# Altium schematic sheet mcu_stm32h5.SchDoc
size D; SheetNumber: 2
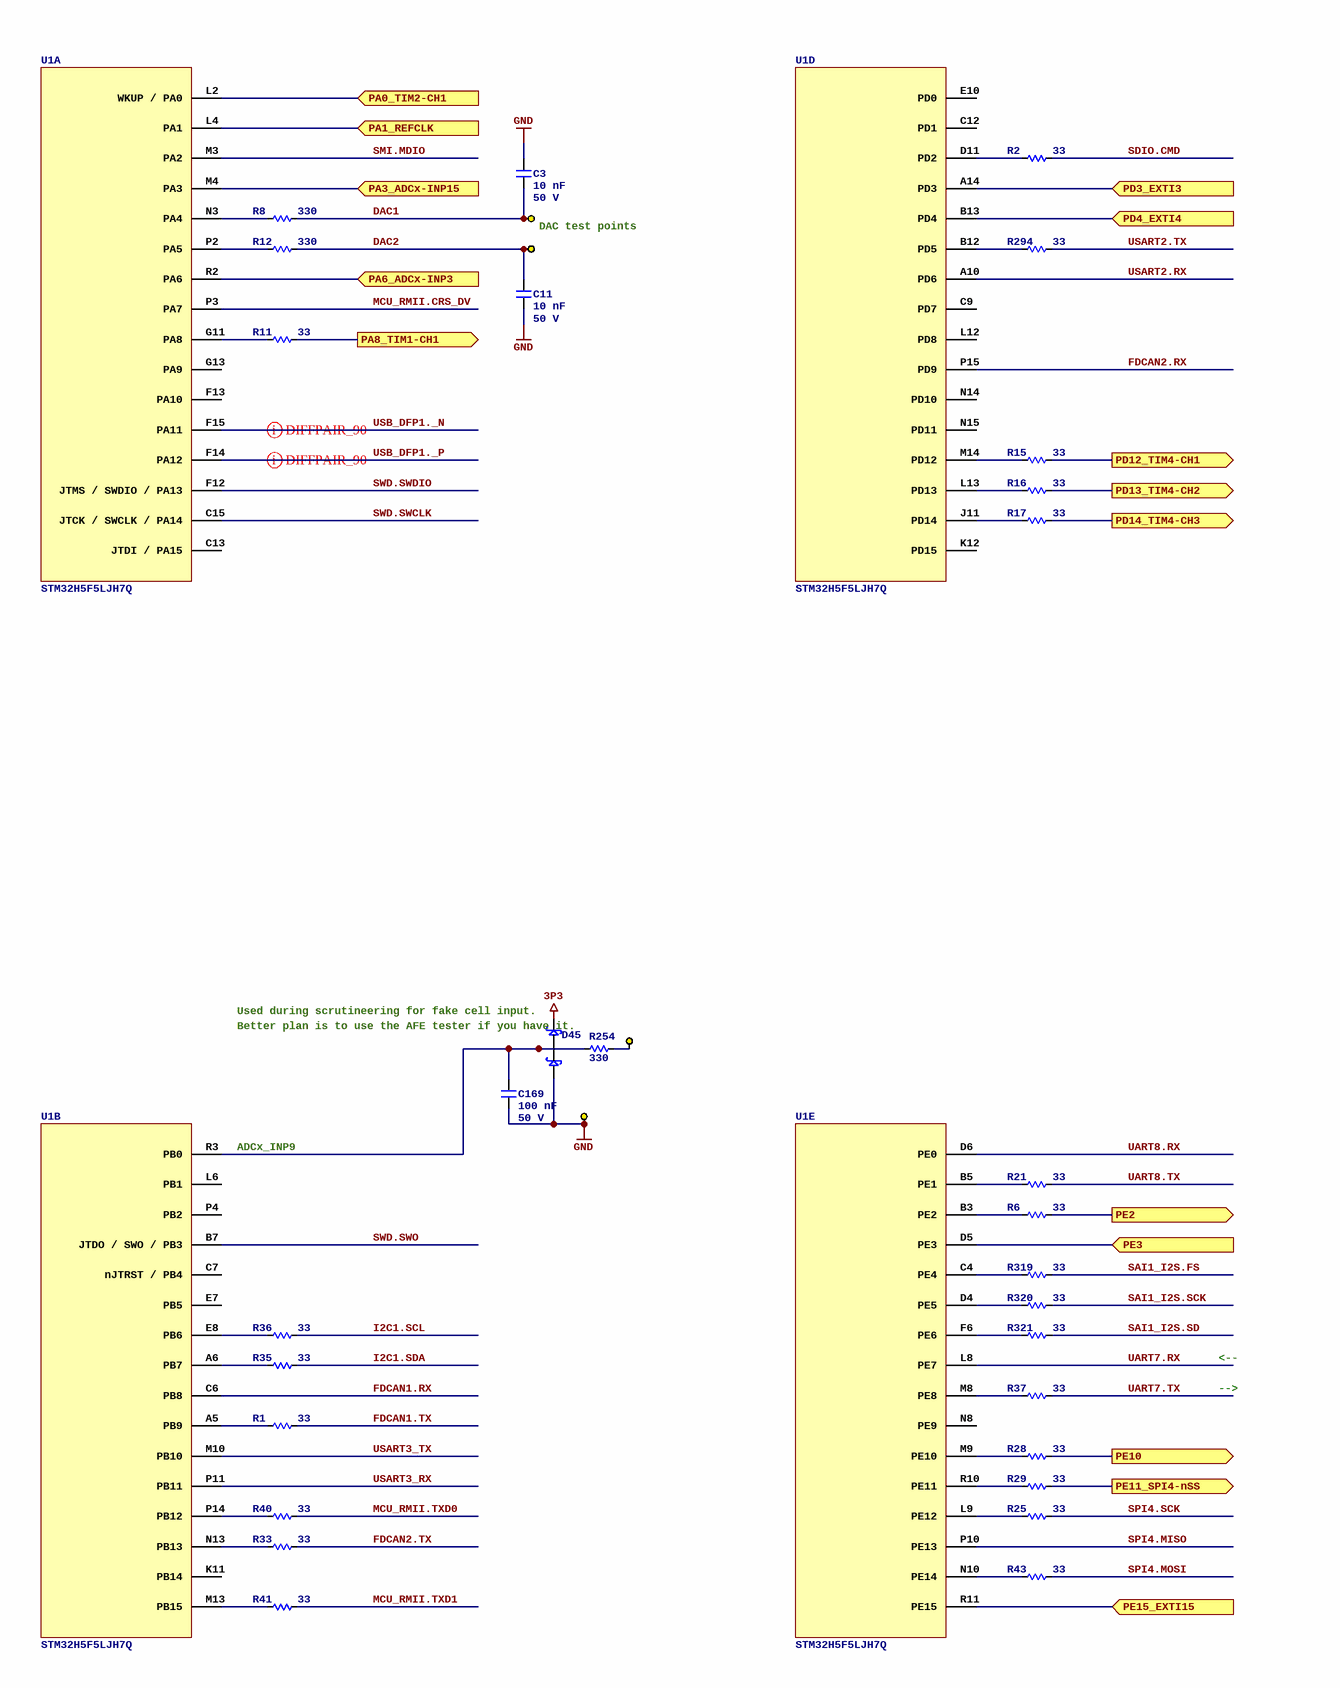
[diagram p0: mcu_stm32h5.SchDoc, top left]
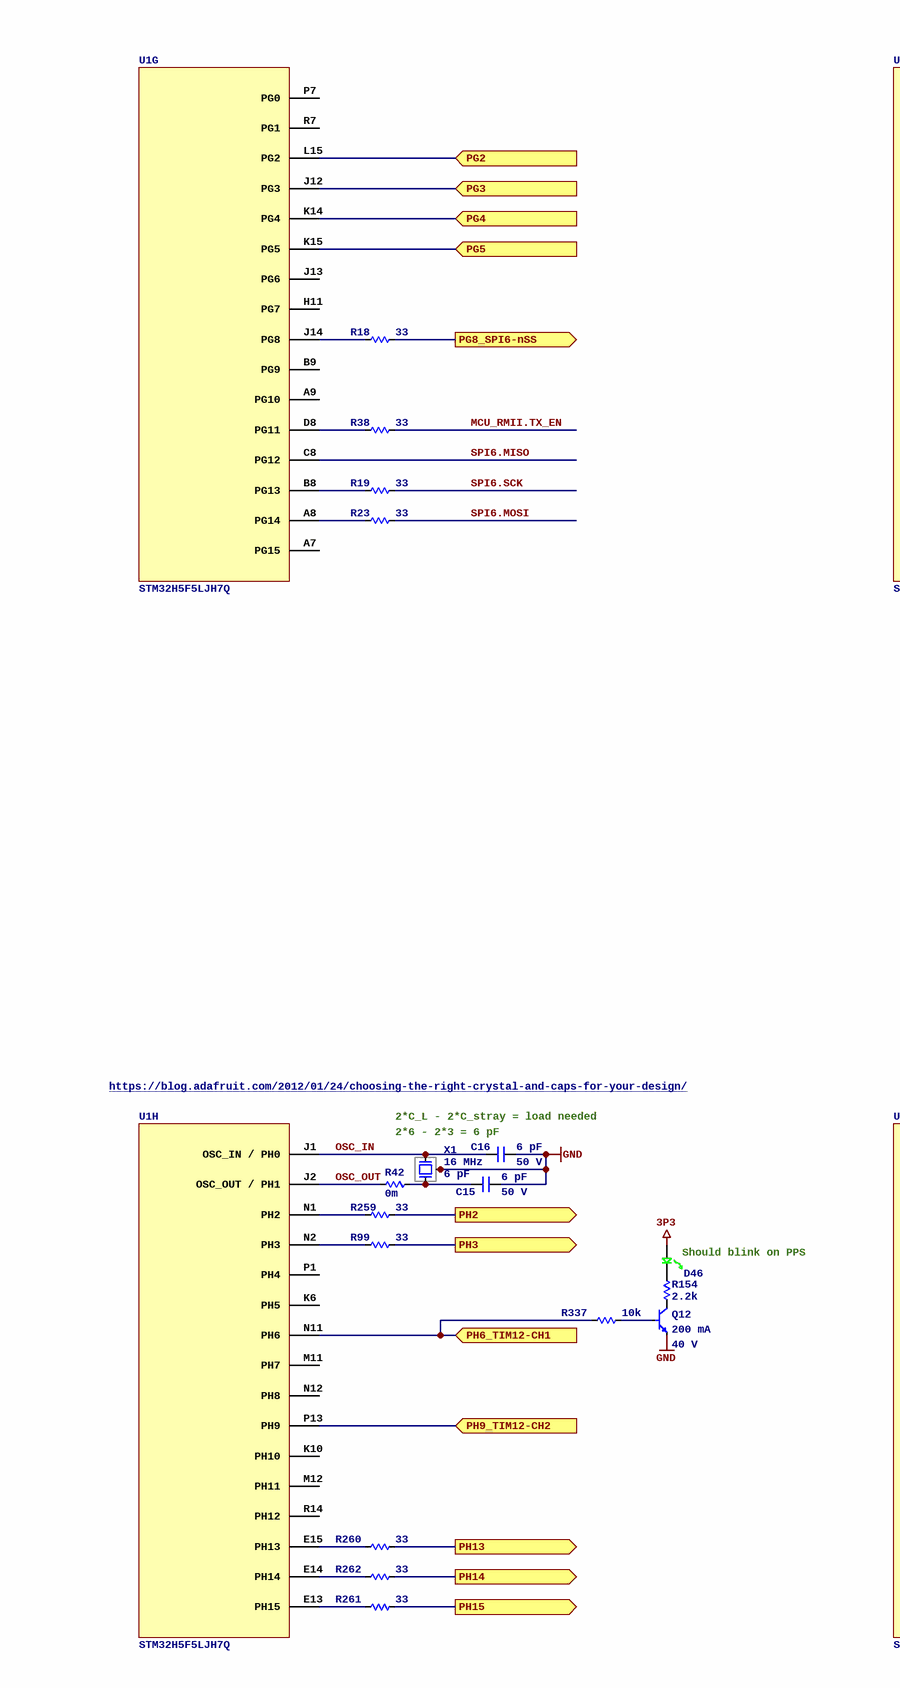
[diagram p1: mcu_stm32h5.SchDoc, top middle]
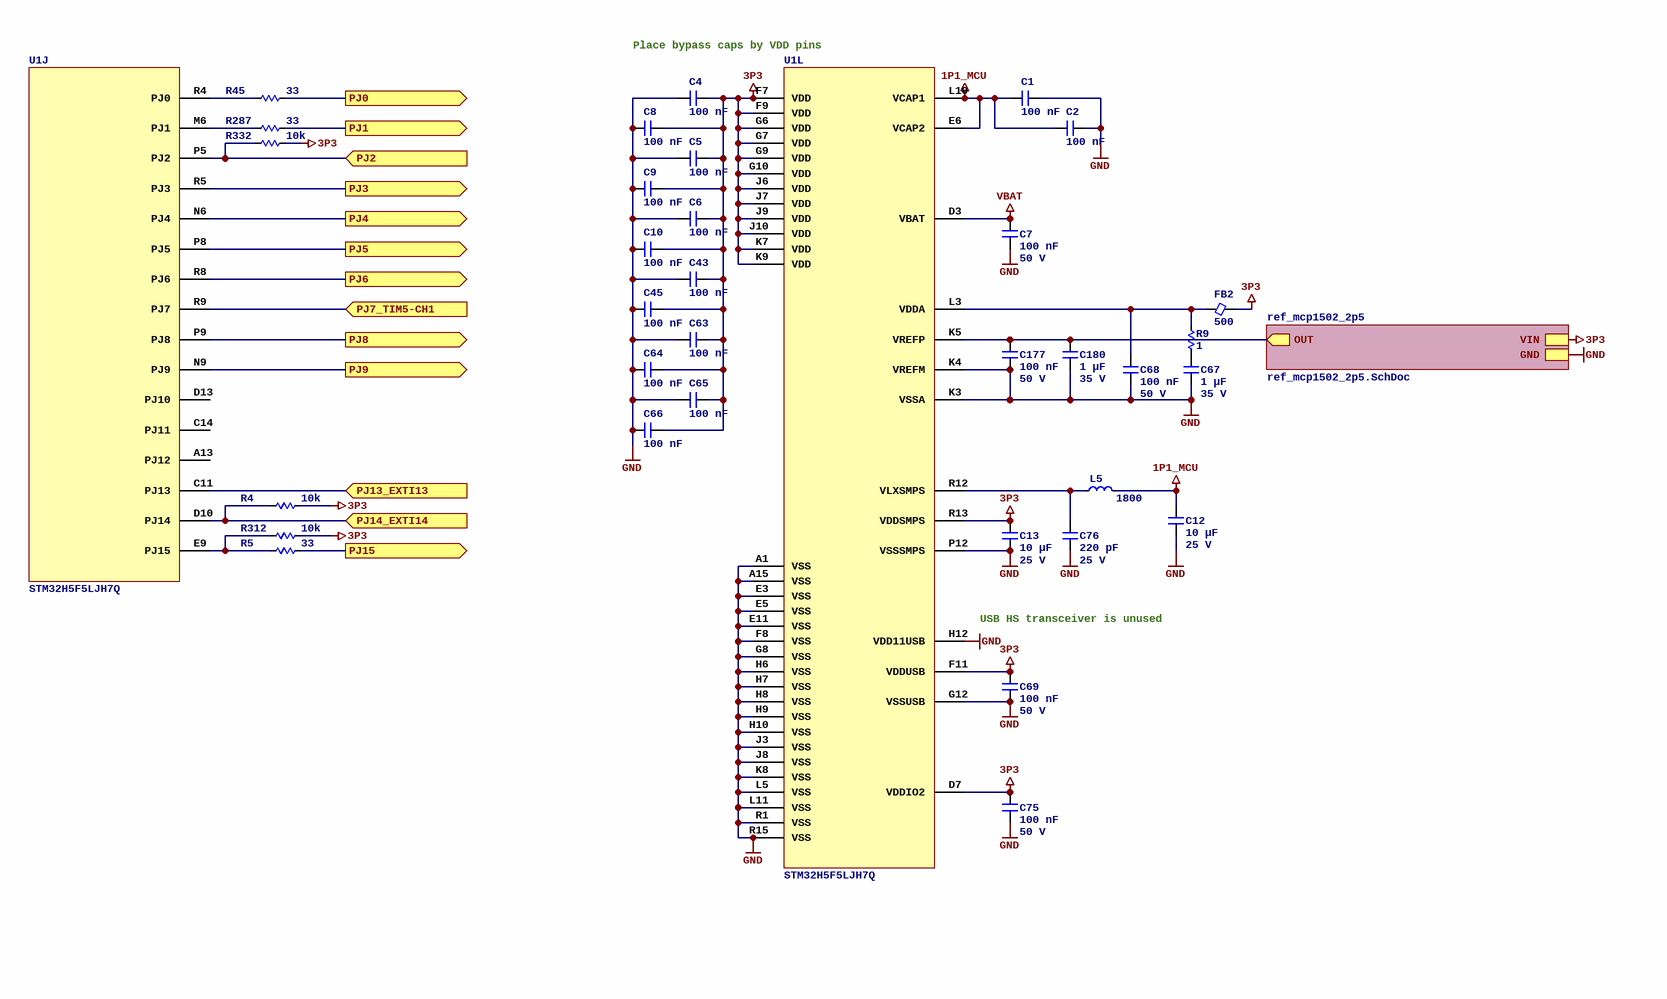
[diagram p2: mcu_stm32h5.SchDoc, top right]
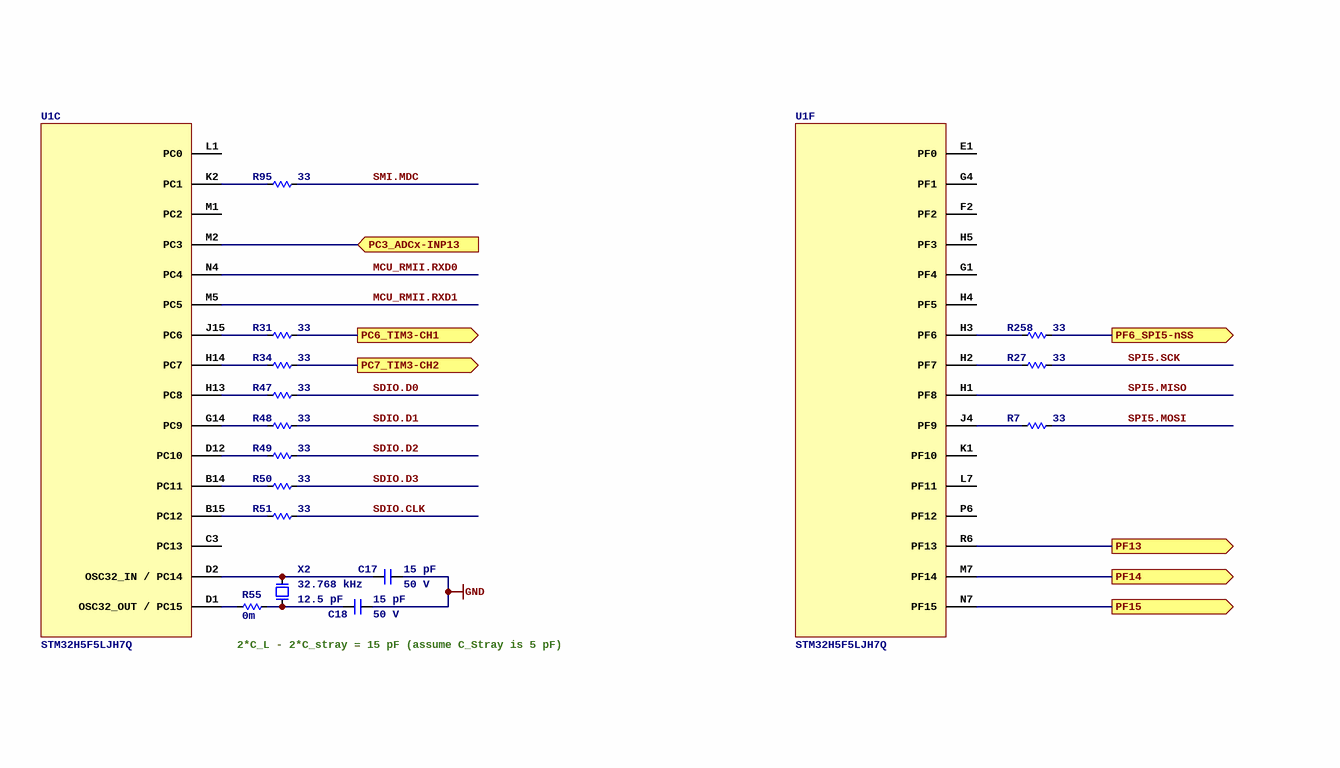
[diagram p3: mcu_stm32h5.SchDoc, bottom left]
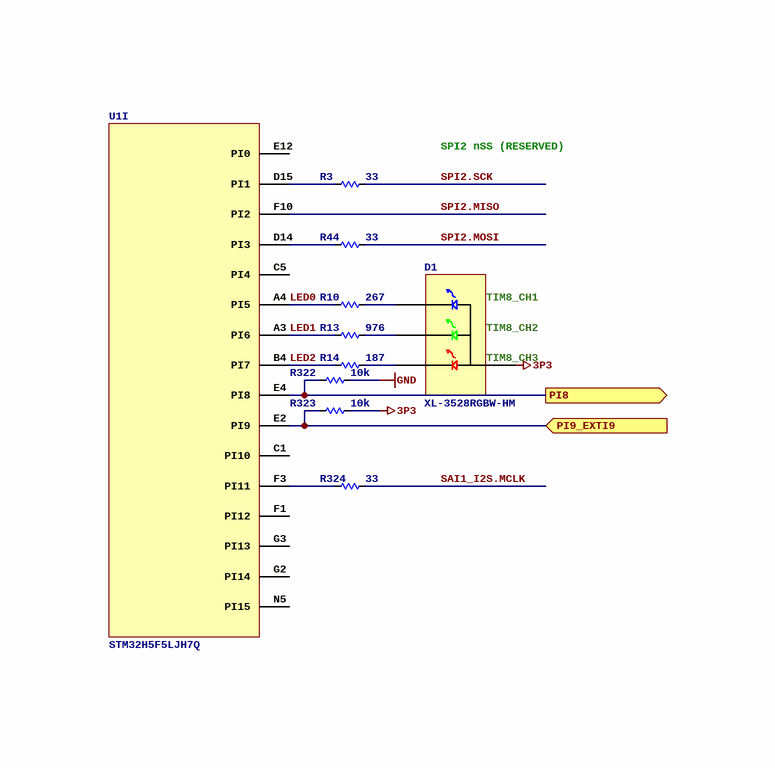
[diagram p4: mcu_stm32h5.SchDoc, bottom middle]
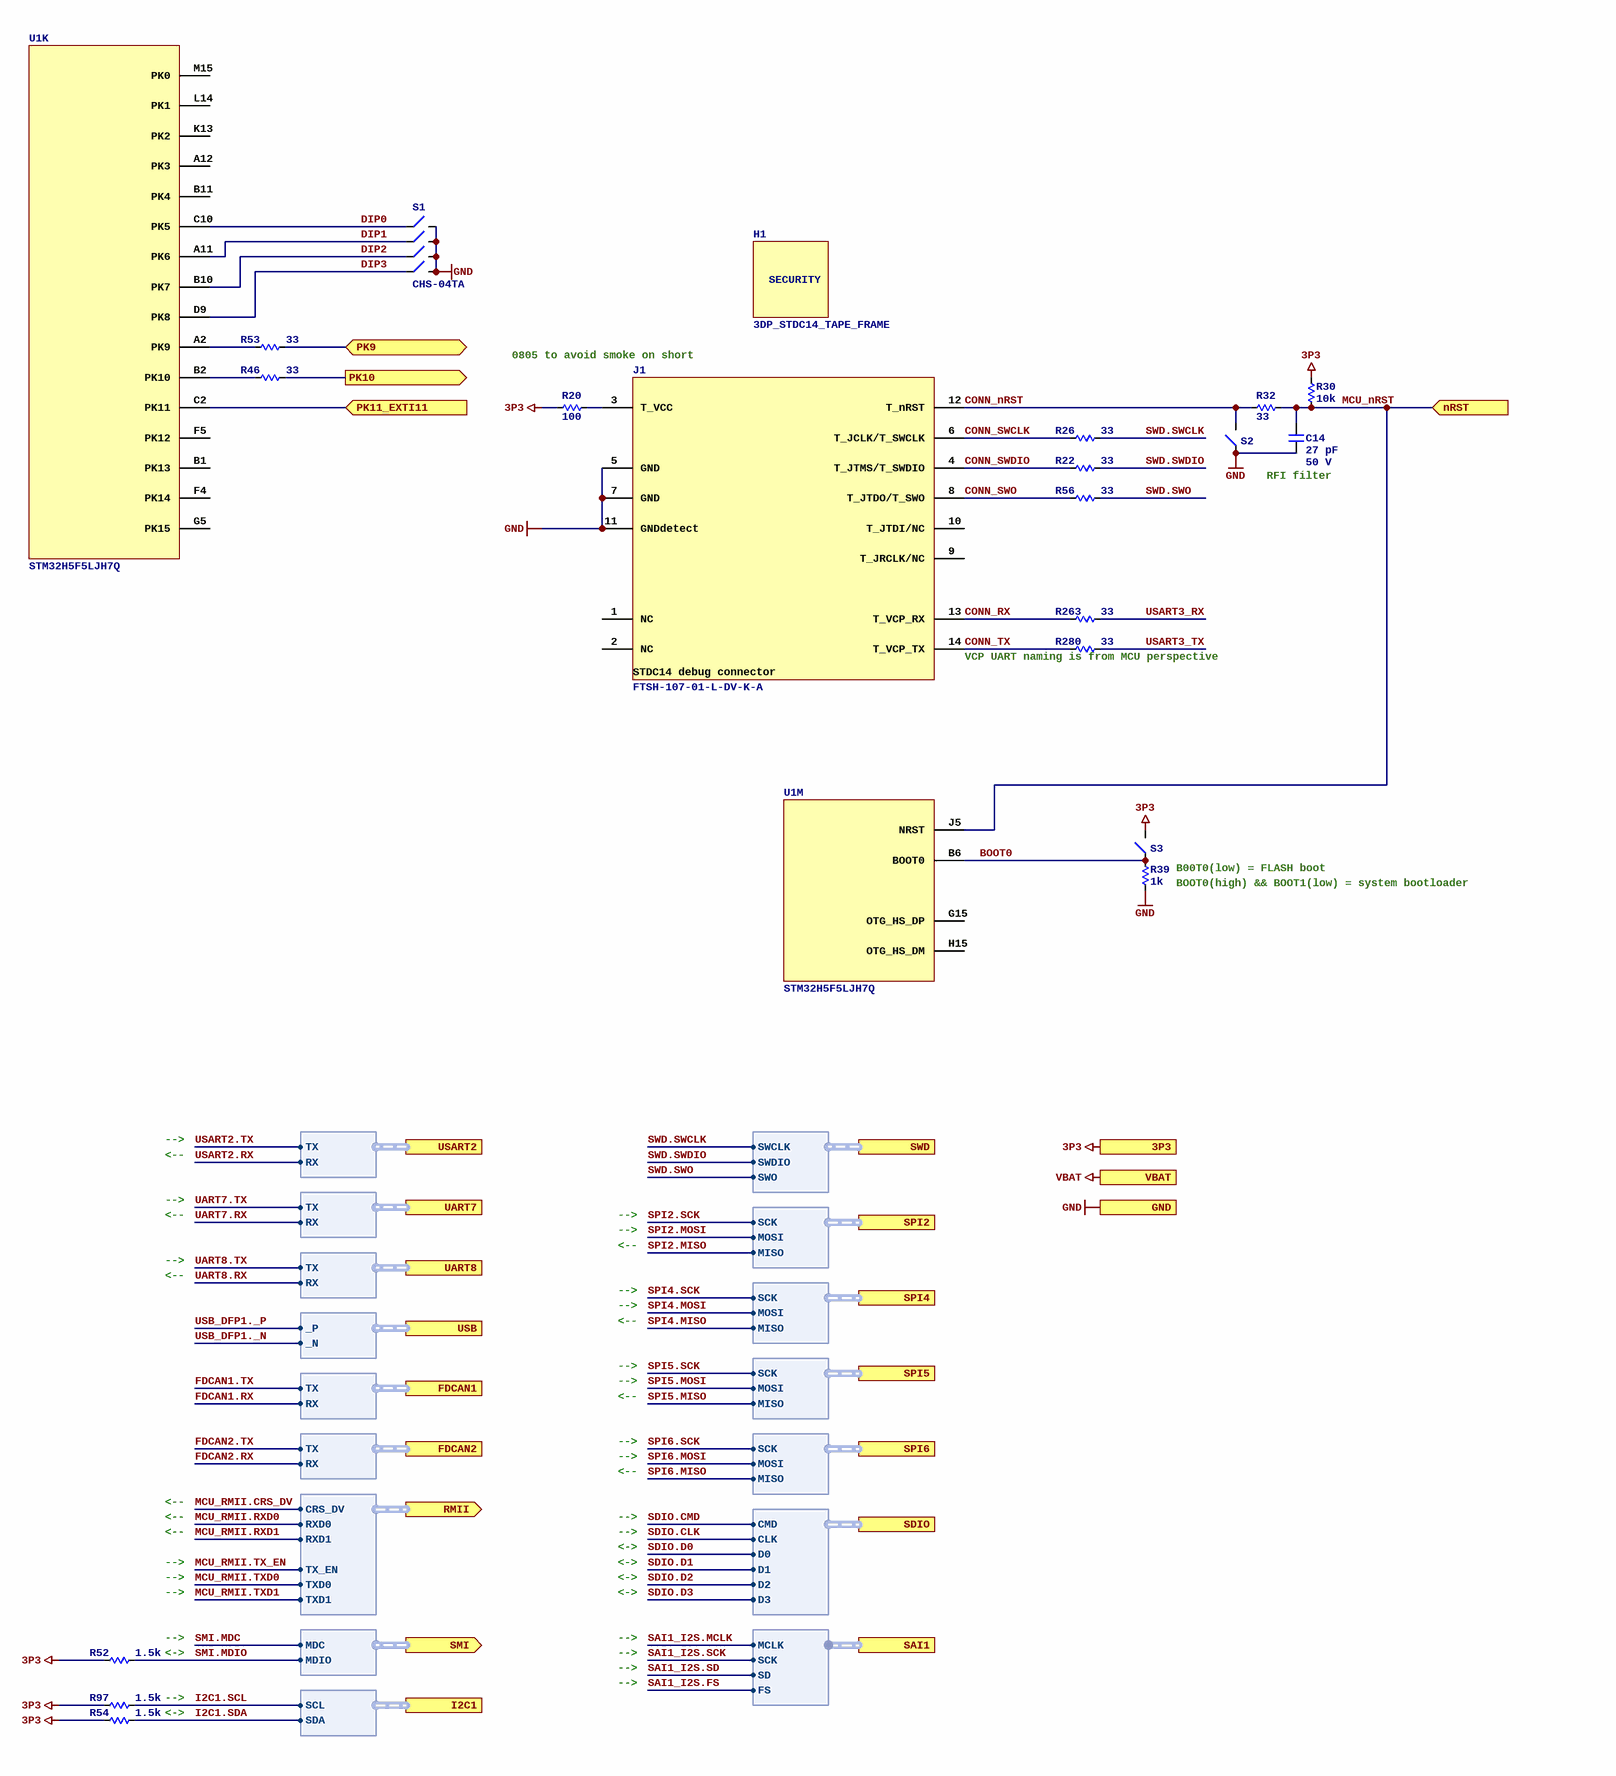
[diagram p5: mcu_stm32h5.SchDoc, bottom right]

## Parts
C1  Capacitance: 100 nF  [C0402]  (hidden comment: CL05B104KB54PNC)
C2  Capacitance: 100 nF  [C0402]  (hidden comment: CL05B104KB54PNC)
C3  Capacitance: 10 nF  Voltage Rating: 50 V  [C0402]  (hidden comment: CL05B103KB5NNNC)
C4  Capacitance: 100 nF  [C0402]  (hidden comment: CL05B104KB54PNC)
C5  Capacitance: 100 nF  [C0402]  (hidden comment: CL05B104KB54PNC)
C6  Capacitance: 100 nF  [C0402]  (hidden comment: CL05B104KB54PNC)
C7  Capacitance: 100 nF  Voltage Rating: 50 V  [C0402]  (hidden comment: CL05B104KB54PNC)
C8  Capacitance: 100 nF  [C0402]  (hidden comment: CL05B104KB54PNC)
C9  Capacitance: 100 nF  [C0402]  (hidden comment: CL05B104KB54PNC)
C10  Capacitance: 100 nF  [C0402]  (hidden comment: CL05B104KB54PNC)
C11  Capacitance: 10 nF  Voltage Rating: 50 V  [C0402]  (hidden comment: CL05B103KB5NNNC)
C12  Capacitance: 10 µF  Voltage Rating: 25 V  [C0603]  (hidden comment: CL10A106MA8NRNC)
C13  Capacitance: 10 µF  Voltage Rating: 25 V  [C0603]  (hidden comment: CL10A106MA8NRNC)
C14  Capacitance: 27 pF  Voltage Rating: 50 V  [C0402]  (hidden comment: 0402CG270J500NT)
C15  Capacitance: 6 pF  Voltage Rating: 50 V  [C0402]  (hidden comment: 0402CG6R0C500NT)
C16  Capacitance: 6 pF  Voltage Rating: 50 V  [C0402]  (hidden comment: 0402CG6R0C500NT)
C17  Capacitance: 15 pF  Voltage Rating: 50 V  [C0402]  (hidden comment: 0402CG150J500NT)
C18  Capacitance: 15 pF  Voltage Rating: 50 V  [C0402]  (hidden comment: 0402CG150J500NT)
C43  Capacitance: 100 nF  [C0402]  (hidden comment: CL05B104KB54PNC)
C45  Capacitance: 100 nF  [C0402]  (hidden comment: CL05B104KB54PNC)
C63  Capacitance: 100 nF  [C0402]  (hidden comment: CL05B104KB54PNC)
C64  Capacitance: 100 nF  [C0402]  (hidden comment: CL05B104KB54PNC)
C65  Capacitance: 100 nF  [C0402]  (hidden comment: CL05B104KB54PNC)
C66  Capacitance: 100 nF  [C0402]  (hidden comment: CL05B104KB54PNC)
C67  Capacitance: 1 µF  Voltage Rating: 35 V  [C0603]  (hidden comment: GMK107AB7105KAHT)
C68  Capacitance: 100 nF  Voltage Rating: 50 V  [C0402]  (hidden comment: CL05B104KB54PNC)
C69  Capacitance: 100 nF  Voltage Rating: 50 V  [C0402]  (hidden comment: CL05B104KB54PNC)
C75  Capacitance: 100 nF  Voltage Rating: 50 V  [C0402]  (hidden comment: CL05B104KB54PNC)
C76  Capacitance: 220 pF  Voltage Rating: 25 V  [C0402]  (hidden comment: 04023A221JAT2A)
C169  Capacitance: 100 nF  Voltage Rating: 50 V  [C0402]  (hidden comment: CL05B104KB54PNC)
C177  Capacitance: 100 nF  Voltage Rating: 50 V  [C0402]  (hidden comment: CL05B104KB54PNC)
C180  Capacitance: 1 µF  Voltage Rating: 35 V  [C0603]  (hidden comment: GMK107AB7105KAHT)
D1  XL-3528RGBW-HM  [LED_RGB_SMD3528-4P]
D45  BAT54SLT1G  [3SOT23]  (value not drawn)
D46  LTST-C190GKT  [LED_0603P_GREEN]  (value not drawn)
FB2  Current Rating (mA): 500  [FB0402]  (hidden comment: BLM15AX601SN1D)
H1  3DP_STDC14_TAPE_FRAME  [3DP_STDC14_TAPE_FRAME]
J1  FTSH-107-01-L-DV-K-A  [SAMTEC_FTSH-107-01-L-DV-K-A]
L5  Current Rating (mA): 1800  [MURATA_DFE201612E]  (hidden comment: DFE201612E-2R2M=P2)
Q12  Current: 200 mA  Voltage: 40 V  [3SOT523]  (hidden comment: MMBT3904T)
R1  value 33  [R0402]  (hidden comment: 0402WGF330JTCE)
R2  value 33  [R0402]  (hidden comment: 0402WGF330JTCE)
R3  value 33  [R0402]  (hidden comment: 0402WGF330JTCE)
R4  value 10k  [R0402]  (hidden comment: 0402WGF1002TCE)
R5  value 33  [R0402]  (hidden comment: 0402WGF330JTCE)
R6  value 33  [R0402]  (hidden comment: 0402WGF330JTCE)
R7  value 33  [R0402]  (hidden comment: 0402WGF330JTCE)
R8  value 330  [R0402]  (hidden comment: 0402WGF3300TCE)
R9  value 1  [R0402]  (hidden comment: CRCW04021R00FKEDC)
R10  value 267  [R0402]  (hidden comment: FRC0402F2670TS)
R11  value 33  [R0402]  (hidden comment: 0402WGF330JTCE)
R12  value 330  [R0402]  (hidden comment: 0402WGF3300TCE)
R13  value 976  [R0402]  (hidden comment: RTT029760FTH)
R14  value 187  [R0402]  (hidden comment: ERJ2RKF1870X)
R15  value 33  [R0402]  (hidden comment: 0402WGF330JTCE)
R16  value 33  [R0402]  (hidden comment: 0402WGF330JTCE)
R17  value 33  [R0402]  (hidden comment: 0402WGF330JTCE)
R18  value 33  [R0402]  (hidden comment: 0402WGF330JTCE)
R19  value 33  [R0402]  (hidden comment: 0402WGF330JTCE)
R20  value 100  [R0805]  (hidden comment: ERJP06F1000V)
R21  value 33  [R0402]  (hidden comment: 0402WGF330JTCE)
R22  value 33  [R0402]  (hidden comment: 0402WGF330JTCE)
R23  value 33  [R0402]  (hidden comment: 0402WGF330JTCE)
R25  value 33  [R0402]  (hidden comment: 0402WGF330JTCE)
R26  value 33  [R0402]  (hidden comment: 0402WGF330JTCE)
R27  value 33  [R0402]  (hidden comment: 0402WGF330JTCE)
R28  value 33  [R0402]  (hidden comment: 0402WGF330JTCE)
R29  value 33  [R0402]  (hidden comment: 0402WGF330JTCE)
R30  value 10k  [R0402]  (hidden comment: 0402WGF1002TCE)
R31  value 33  [R0402]  (hidden comment: 0402WGF330JTCE)
R32  value 33  [R0402]  (hidden comment: 0402WGF330JTCE)
R33  value 33  [R0402]  (hidden comment: 0402WGF330JTCE)
R34  value 33  [R0402]  (hidden comment: 0402WGF330JTCE)
R35  value 33  [R0402]  (hidden comment: 0402WGF330JTCE)
R36  value 33  [R0402]  (hidden comment: 0402WGF330JTCE)
R37  value 33  [R0402]  (hidden comment: 0402WGF330JTCE)
R38  value 33  [R0402]  (hidden comment: 0402WGF330JTCE)
R39  value 1k  [R0402]  (hidden comment: 0402WGF1001TCE)
R40  value 33  [R0402]  (hidden comment: 0402WGF330JTCE)
R41  value 33  [R0402]  (hidden comment: 0402WGF330JTCE)
R42  value 0m  [R0402]  (hidden comment: 0402WGF0000TCE)
R43  value 33  [R0402]  (hidden comment: 0402WGF330JTCE)
R44  value 33  [R0402]  (hidden comment: 0402WGF330JTCE)
R45  value 33  [R0402]  (hidden comment: 0402WGF330JTCE)
R46  value 33  [R0402]  (hidden comment: 0402WGF330JTCE)
R47  value 33  [R0402]  (hidden comment: 0402WGF330JTCE)
R48  value 33  [R0402]  (hidden comment: 0402WGF330JTCE)
R49  value 33  [R0402]  (hidden comment: 0402WGF330JTCE)
R50  value 33  [R0402]  (hidden comment: 0402WGF330JTCE)
R51  value 33  [R0402]  (hidden comment: 0402WGF330JTCE)
R52  value 1.5k  [R0402]  (hidden comment: 0402WGF1501TCE)
R53  value 33  [R0402]  (hidden comment: 0402WGF330JTCE)
R54  value 1.5k  [R0402]  (hidden comment: 0402WGF1501TCE)
R55  value 0m  [R0402]  (hidden comment: 0402WGF0000TCE)
R56  value 33  [R0402]  (hidden comment: 0402WGF330JTCE)
R95  value 33  [R0402]  (hidden comment: 0402WGF330JTCE)
R97  value 1.5k  [R0402]  (hidden comment: 0402WGF1501TCE)
R99  value 33  [R0402]  (hidden comment: 0402WGF330JTCE)
R154  value 2.2k  [R0402]  (hidden comment: 0402WGF2201TCE)
R254  value 330  [R0402]  (hidden comment: 0402WGF3300TCE)
R258  value 33  [R0402]  (hidden comment: 0402WGF330JTCE)
R259  value 33  [R0402]  (hidden comment: 0402WGF330JTCE)
R260  value 33  [R0402]  (hidden comment: 0402WGF330JTCE)
R261  value 33  [R0402]  (hidden comment: 0402WGF330JTCE)
R262  value 33  [R0402]  (hidden comment: 0402WGF330JTCE)
R263  value 33  [R0402]  (hidden comment: 0402WGF330JTCE)
R280  value 33  [R0402]  (hidden comment: 0402WGF330JTCE)
R287  value 33  [R0402]  (hidden comment: 0402WGF330JTCE)
R294  value 33  [R0402]  (hidden comment: 0402WGF330JTCE)
R312  value 10k  [R0402]  (hidden comment: 0402WGF1002TCE)
R319  value 33  [R0402]  (hidden comment: 0402WGF330JTCE)
R320  value 33  [R0402]  (hidden comment: 0402WGF330JTCE)
R321  value 33  [R0402]  (hidden comment: 0402WGF330JTCE)
R322  value 10k  [R0402]  (hidden comment: 0402WGF1002TCE)
R323  value 10k  [R0402]  (hidden comment: 0402WGF1002TCE)
R324  value 33  [R0402]  (hidden comment: 0402WGF330JTCE)
R332  value 10k  [R0402]  (hidden comment: 0402WGF1002TCE)
R337  value 10k  [R0402]  (hidden comment: 0402WGF1002TCE)
S1  CHS-04TA  [SWITCH_NIDEC_CHS-04TA]
S2  TS-1092S-B3D2-G  [SWITCH_TS-1092S-B3D2-G]  (value not drawn)
S3  TS-1092S-B3D2-G  [SWITCH_TS-1092S-B3D2-G]  (value not drawn)
TP1  RH-5002  [TP_RH-5002]  (value not drawn)
TP2  RH-5002  [TP_RH-5002]  (value not drawn)
TP51  RH-5000  [TP_RH-5000]  (value not drawn)
TP52  RH-5001  [TP_RH-5001]  (value not drawn)
U1  STM32H5F5LJH7Q  [ST_TFBGA225]  (parts A,B,C,D,E,F,G,H,I,J,K,L,M of 13)
X1  Frequency: 16 MHz  Capacitance: 6 pF  [4_SMD_2.0X1.6MM]  (hidden comment: XRCGB16M000FXN00R0)
X2  Frequency: 32.768 kHz  Capacitance: 12.5 pF  [XTAL_TXC_9HT10]  (hidden comment: 9HT10-32.768KEZF-T)

## Sub-sheets
ref_mcp1502_2p5 = ref_mcp1502_2p5.SchDoc: VIN, GND, OUT (out)

## Ports
3P3, FDCAN1 (harness CAN), FDCAN2 (harness CAN), GND, I2C1 (harness I2C), nRST (in), PA0_TIM2-CH1 (in), PA1_REFCLK (in), PA3_ADCx-INP15 (in), PA6_ADCx-INP3 (in), PA8_TIM1-CH1 (out), PC3_ADCx-INP13 (in), PC6_TIM3-CH1 (out), PC7_TIM3-CH2 (out), PD3_EXTI3 (in), PD4_EXTI4 (in), PD12_TIM4-CH1 (out), PD13_TIM4-CH2 (out), PD14_TIM4-CH3 (out), PE2 (out), PE3 (in), PE10 (out), PE11_SPI4-nSS (out), PE15_EXTI15 (in), PF6_SPI5-nSS (out), PF13 (out), PF14 (out), PF15 (out), PG2 (in), PG3 (in), PG4 (in), PG5 (in), PG8_SPI6-nSS (out), PH2 (out), PH3 (out), PH6_TIM12-CH1 (in), PH9_TIM12-CH2 (in), PH13 (out), PH14 (out), PH15 (out), PI8 (out), PI9_EXTI9 (in), PJ0 (out), PJ1 (out), PJ2 (in), PJ3 (out), PJ4 (out), PJ5 (out), PJ6 (out), PJ7_TIM5-CH1 (in), PJ8 (out), PJ9 (out), PJ13_EXTI13 (in), PJ14_EXTI14 (in), PJ15 (out), PK9 (bidir), PK10 (out), PK11_EXTI11 (in), RMII (out, harness RMII), SAI1 (harness I2S), SDIO (harness SDIO), SMI (out, harness SMI), SPI2 (harness SPI), SPI4 (harness SPI), SPI5 (harness SPI), SPI6 (harness SPI), SWD (harness SWD), UART7 (harness UART), UART8 (harness UART), USART2 (harness UART), USB (harness DIFF), VBAT

## Harnesses
CAN: TX, RX
SDIO: CLK, CMD, D0, D1, D2, D3
SPI: MISO, MOSI, SCK
RMII: CRS_DV, RXD0, RXD1, TX_EN, TXD0, TXD1
SMI: MDC, MDIO
DIFF: _P, _N
SWD: SWCLK, SWDIO, SWO
UART: RX, TX
I2C: SCL, SDA
I2S: MCLK, SCK, SD, FS

## Nets
1P1_MCU: C1.1 C2.1 C12.1 L5.2 U1.E6(VCAP2) U1.L10(VCAP1)
3P3: C4.1 C5.1 C6.1 C8.1 C9.1 C10.1 C13.1 C43.1 C45.1 C63.1 C64.1 C65.1 C66.1 C69.1 C75.1 D1.2 D45.2 D46.1 FB2.2 R4.1 R20.2 R30.1 R52.2 R54.2 R97.2 R312.1 R323.1 R332.2 S3.2 U1.D7(VDDIO2) U1.F7(VDD) U1.F9(VDD) U1.F11(VDDUSB) U1.G6(VDD) U1.G7(VDD) U1.G9(VDD) U1.G10(VDD) U1.J6(VDD) U1.J7(VDD) U1.J9(VDD) U1.J10(VDD) U1.K7(VDD) U1.K9(VDD) U1.R13(VDDSMPS) ; port 3P3, sheet ref_mcp1502_2p5/VIN
GND: C1.2 C2.2 C3.2 C4.2 C5.2 C6.2 C7.2 C8.2 C9.2 C10.2 C11.2 C12.2 C13.2 C14.2 C15.2 C16.2 C17.2 C18.2 C43.2 C45.2 C63.2 C64.2 C65.2 C66.2 C67.2 C68.2 C69.2 C75.2 C76.1 C169.2 C177.2 C180.2 D45.1 J1.5(GND) J1.7(GND) J1.11(GNDdetect) Q12.2(E) R39.2 R322.1 S1.2 S1.4 S1.6 S1.8 S2.1 TP52.1 U1.A1(VSS) U1.A15(VSS) U1.E3(VSS) U1.E5(VSS) U1.E11(VSS) U1.F8(VSS) U1.G8(VSS) U1.G12(VSSUSB) U1.H6(VSS) U1.H7(VSS) U1.H8(VSS) U1.H9(VSS) U1.H10(VSS) U1.H12(VDD11USB) U1.J3(VSS) U1.J8(VSS) U1.K3(VSSA) U1.K4(VREFM) U1.K8(VSS) U1.L5(VSS) U1.L11(VSS) U1.P12(VSSSMPS) U1.R1(VSS) U1.R15(VSS) X1.2 X1.4 ; port GND, sheet ref_mcp1502_2p5/GND
VBAT: C7.1 U1.D3(VBAT) ; port VBAT
BOOT0: R39.1 S3.1 U1.B6(BOOT0)
CONN_nRST: J1.12(T_nRST) R32.2 S2.2
CONN_RX: J1.13(T_VCP_RX) R263.2
CONN_SWCLK: J1.6(T_JCLK/T_SWCLK) R26.2
CONN_SWDIO: J1.4(T_JTMS/T_SWDIO) R22.2
CONN_SWO: J1.8(T_JTDO/T_SWO) R56.2
CONN_TX: J1.14(T_VCP_TX) R280.2
DAC1: C3.1 R8.2 TP1.1
DAC2: C11.1 R12.2 TP2.1
DIP0: S1.1 U1.C10(PK5)
DIP1: S1.3 U1.A11(PK6)
DIP2: S1.5 U1.B10(PK7)
DIP3: S1.7 U1.D9(PK8)
FDCAN1.RX: U1.C6(PB8) ; port FDCAN1.RX
FDCAN1.TX: R1.1 ; port FDCAN1.TX
FDCAN2.RX: U1.P15(PD9) ; port FDCAN2.RX
FDCAN2.TX: R33.1 ; port FDCAN2.TX
I2C1.SCL: R36.1 R97.1 ; port I2C1.SCL
I2C1.SDA: R35.1 R54.1 ; port I2C1.SDA
LED0: R10.2 U1.A4(PI5)
LED1: R13.2 U1.A3(PI6)
LED2: R14.2 U1.B4(PI7)
MCU_nRST: C14.1 R30.2 R32.1 U1.J5(NRST) ; port nRST
MCU_RMII.CRS_DV: U1.P3(PA7) ; port RMII.CRS_DV
MCU_RMII.RXD0: U1.N4(PC4) ; port RMII.RXD0
MCU_RMII.RXD1: U1.M5(PC5) ; port RMII.RXD1
MCU_RMII.TX_EN: R38.1 ; port RMII.TX_EN
MCU_RMII.TXD0: R40.1 ; port RMII.TXD0
MCU_RMII.TXD1: R41.1 ; port RMII.TXD1
OSC_IN: C16.1 U1.J1(OSC_IN_/_PH0) X1.3
OSC_OUT: R42.1 U1.J2(OSC_OUT_/_PH1)
PA0_TIM2-CH1: U1.L2(WKUP_/_PA0) ; port PA0_TIM2-CH1
PA1_REFCLK: U1.L4(PA1) ; port PA1_REFCLK
PA3_ADCx-INP15: U1.M4(PA3) ; port PA3_ADCx-INP15
PA6_ADCx-INP3: U1.R2(PA6) ; port PA6_ADCx-INP3
PA8_TIM1-CH1: R11.1 ; port PA8_TIM1-CH1
PC3_ADCx-INP13: U1.M2(PC3) ; port PC3_ADCx-INP13
PC6_TIM3-CH1: R31.1 ; port PC6_TIM3-CH1
PC7_TIM3-CH2: R34.1 ; port PC7_TIM3-CH2
PD3_EXTI3: U1.A14(PD3) ; port PD3_EXTI3
PD4_EXTI4: U1.B13(PD4) ; port PD4_EXTI4
PD12_TIM4-CH1: R15.1 ; port PD12_TIM4-CH1
PD13_TIM4-CH2: R16.1 ; port PD13_TIM4-CH2
PD14_TIM4-CH3: R17.1 ; port PD14_TIM4-CH3
PE2: R6.1 ; port PE2
PE3: U1.D5(PE3) ; port PE3
PE10: R28.1 ; port PE10
PE11_SPI4-nSS: R29.1 ; port PE11_SPI4-nSS
PE15_EXTI15: U1.R11(PE15) ; port PE15_EXTI15
PF6_SPI5-nSS: R258.1 ; port PF6_SPI5-nSS
PF13: U1.R6(PF13) ; port PF13
PF14: U1.M7(PF14) ; port PF14
PF15: U1.N7(PF15) ; port PF15
PG2: U1.L15(PG2) ; port PG2
PG3: U1.J12(PG3) ; port PG3
PG4: U1.K14(PG4) ; port PG4
PG5: U1.K15(PG5) ; port PG5
PG8_SPI6-nSS: R18.1 ; port PG8_SPI6-nSS
PH2: R259.1 ; port PH2
PH3: R99.1 ; port PH3
PH6_TIM12-CH1: R337.2 U1.N11(PH6) ; port PH6_TIM12-CH1
PH9_TIM12-CH2: U1.P13(PH9) ; port PH9_TIM12-CH2
PH13: R260.1 ; port PH13
PH14: R262.1 ; port PH14
PH15: R261.1 ; port PH15
PI8: R322.2 U1.E4(PI8) ; port PI8
PI9_EXTI9: R323.2 U1.E2(PI9) ; port PI9_EXTI9
PJ0: R45.1 ; port PJ0
PJ1: R287.1 ; port PJ1
PJ2: R332.1 U1.P5(PJ2) ; port PJ2
PJ3: U1.R5(PJ3) ; port PJ3
PJ4: U1.N6(PJ4) ; port PJ4
PJ5: U1.P8(PJ5) ; port PJ5
PJ6: U1.R8(PJ6) ; port PJ6
PJ7_TIM5-CH1: U1.R9(PJ7) ; port PJ7_TIM5-CH1
PJ8: U1.P9(PJ8) ; port PJ8
PJ9: U1.N9(PJ9) ; port PJ9
PJ13_EXTI13: U1.C11(PJ13) ; port PJ13_EXTI13
PJ14_EXTI14: R4.2 U1.D10(PJ14) ; port PJ14_EXTI14
PJ15: R5.1 ; port PJ15
PK9: R53.1 ; port PK9
PK10: R46.1 ; port PK10
PK11_EXTI11: U1.C2(PK11) ; port PK11_EXTI11
SAI1_I2S.FS: R319.1 ; port SAI1.FS
SAI1_I2S.MCLK: R324.1 ; port SAI1.MCLK
SAI1_I2S.SCK: R320.1 ; port SAI1.SCK
SAI1_I2S.SD: R321.1 ; port SAI1.SD
SDIO.CLK: R51.1 ; port SDIO.CLK
SDIO.CMD: R2.1 ; port SDIO.CMD
SDIO.D0: R47.1 ; port SDIO.D0
SDIO.D1: R48.1 ; port SDIO.D1
SDIO.D2: R49.1 ; port SDIO.D2
SDIO.D3: R50.1 ; port SDIO.D3
SMI.MDC: R95.1 ; port SMI.MDC
SMI.MDIO: R52.1 U1.M3(PA2) ; port SMI.MDIO
SPI2.MISO: U1.F10(PI2) ; port SPI2.MISO
SPI2.MOSI: R44.1 ; port SPI2.MOSI
SPI2.SCK: R3.1 ; port SPI2.SCK
SPI4.MISO: U1.P10(PE13) ; port SPI4.MISO
SPI4.MOSI: R43.1 ; port SPI4.MOSI
SPI4.SCK: R25.1 ; port SPI4.SCK
SPI5.MISO: U1.H1(PF8) ; port SPI5.MISO
SPI5.MOSI: R7.1 ; port SPI5.MOSI
SPI5.SCK: R27.1 ; port SPI5.SCK
SPI6.MISO: U1.C8(PG12) ; port SPI6.MISO
SPI6.MOSI: R23.1 ; port SPI6.MOSI
SPI6.SCK: R19.1 ; port SPI6.SCK
SWD.SWCLK: R26.1 U1.C15(JTCK_/_SWCLK_/_PA14) ; port SWD.SWCLK
SWD.SWDIO: R22.1 U1.F12(JTMS_/_SWDIO_/_PA13) ; port SWD.SWDIO
SWD.SWO: R56.1 U1.B7(JTDO_/_SWO_/_PB3) ; port SWD.SWO
UART7.RX: U1.L8(PE7) ; port UART7.RX
UART7.TX: R37.1 ; port UART7.TX
UART8.RX: U1.D6(PE0) ; port UART8.RX
UART8.TX: R21.1 ; port UART8.TX
USART2.RX: U1.A10(PD6) ; port USART2.RX
USART2.TX: R294.1 ; port USART2.TX
USART3_RX: R263.1 U1.P11(PB11)
USART3_TX: R280.1 U1.M10(PB10)
USB_DFP1._N: U1.F15(PA11) ; port USB._N
USB_DFP1._P: U1.F14(PA12) ; port USB._P
NetC15_1: C15.1 R42.2 X1.1
NetC17_1: C17.1 U1.D2(OSC32_IN_/_PC14) X2.2
NetC18_1: C18.1 R55.2 X2.1
NetC67_1: C67.1 R9.1
NetC68_1: C68.1 FB2.1 R9.2 U1.L3(VDDA)
NetC76_2: C76.2 L5.1 U1.R12(VLXSMPS)
NetC169_1: C169.1 D45.3 R254.1 U1.R3(PB0)
NetC177_1: C177.1 C180.1 U1.K5(VREFP) ; sheet ref_mcp1502_2p5/OUT
NetD1_1: D1.1 R14.1
NetD1_3: D1.3 R13.1
NetD1_4: D1.4 R10.1
NetD46_2: D46.2 R154.1
NetJ1_3: J1.3(T_VCC) R20.1
NetQ12_1: Q12.1(B) R337.1
NetQ12_3: Q12.3(C) R154.2
NetR1_2: R1.2 U1.A5(PB9)
NetR2_2: R2.2 U1.D11(PD2)
NetR3_2: R3.2 U1.D15(PI1)
NetR5_2: R5.2 R312.2 U1.E9(PJ15)
NetR6_2: R6.2 U1.B3(PE2)
NetR7_2: R7.2 U1.J4(PF9)
NetR8_1: R8.1 U1.N3(PA4)
NetR11_2: R11.2 U1.G11(PA8)
NetR12_1: R12.1 U1.P2(PA5)
NetR15_2: R15.2 U1.M14(PD12)
NetR16_2: R16.2 U1.L13(PD13)
NetR17_2: R17.2 U1.J11(PD14)
NetR18_2: R18.2 U1.J14(PG8)
NetR19_2: R19.2 U1.B8(PG13)
NetR21_2: R21.2 U1.B5(PE1)
NetR23_2: R23.2 U1.A8(PG14)
NetR25_2: R25.2 U1.L9(PE12)
NetR27_2: R27.2 U1.H2(PF7)
NetR28_2: R28.2 U1.M9(PE10)
NetR29_2: R29.2 U1.R10(PE11)
NetR31_2: R31.2 U1.J15(PC6)
NetR33_2: R33.2 U1.N13(PB13)
NetR34_2: R34.2 U1.H14(PC7)
NetR35_2: R35.2 U1.A6(PB7)
NetR36_2: R36.2 U1.E8(PB6)
NetR37_2: R37.2 U1.M8(PE8)
NetR38_2: R38.2 U1.D8(PG11)
NetR40_2: R40.2 U1.P14(PB12)
NetR41_2: R41.2 U1.M13(PB15)
NetR43_2: R43.2 U1.N10(PE14)
NetR44_2: R44.2 U1.D14(PI3)
NetR45_2: R45.2 U1.R4(PJ0)
NetR46_2: R46.2 U1.B2(PK10)
NetR47_2: R47.2 U1.H13(PC8)
NetR48_2: R48.2 U1.G14(PC9)
NetR49_2: R49.2 U1.D12(PC10)
NetR50_2: R50.2 U1.B14(PC11)
NetR51_2: R51.2 U1.B15(PC12)
NetR53_2: R53.2 U1.A2(PK9)
NetR55_1: R55.1 U1.D1(OSC32_OUT_/_PC15)
NetR95_2: R95.2 U1.K2(PC1)
NetR99_2: R99.2 U1.N2(PH3)
NetR254_2: R254.2 TP51.1
NetR258_2: R258.2 U1.H3(PF6)
NetR259_2: R259.2 U1.N1(PH2)
NetR260_2: R260.2 U1.E15(PH13)
NetR261_2: R261.2 U1.E13(PH15)
NetR262_2: R262.2 U1.E14(PH14)
NetR287_2: R287.2 U1.M6(PJ1)
NetR294_2: R294.2 U1.B12(PD5)
NetR319_2: R319.2 U1.C4(PE4)
NetR320_2: R320.2 U1.D4(PE5)
NetR321_2: R321.2 U1.F6(PE6)
NetR324_2: R324.2 U1.F3(PI11)

Not connected (* = marked no-connect by the designer): J1 1(NC) 2(NC) 9(T_JRCLK/NC) 10(T_JTDI/NC); U1 A7(PG15) A9(PG10) A12(PK3) A13(PJ12) B1(PK13) B9(PG9) B11(PK4) C1(PI10) C3(PC13) C5(PI4) C7(nJTRST_/_PB4) C9(PD7) C12(PD1) C13(JTDI_/_PA15) C14(PJ11) D13(PJ10) E1(PF0) E7(PB5) E10(PD0) E12(PI0) F1(PI12) F2(PF2) F4(PK14) F5(PK12) F13(PA10) G1(PF4) G2(PI14) G3(PI13) G4(PF1) G5(PK15) G13(PA9) G15(OTG_HS_DP) H4(PF5) H5(PF3) H11(PG7) H15(OTG_HS_DM) J13(PG6) K1(PF10) K6(PH5) K10(PH10) K11(PB14) K12(PD15) K13(PK2) L1(PC0) L6(PB1) L7(PF11) L12(PD8) L14(PK1) M1(PC2) M11(PH7) M12(PH11) M15(PK0) N5(PI15) N8(PE9) N12(PH8) N14(PD10) N15(PD11) P1(PH4) P4(PB2) P6(PF12) P7(PG0) R7(PG1) R14(PH12)

## Layout directives
differential pair; differential pair class DE_90: USB_DFP1._N, USB_DFP1._P

## Notes on the sheet
- Place bypass caps by VDD pins
- (near TP1) DAC test points
- USB HS transceiver is unused
- Used during scrutineering for fake cell input.
- (near D45) Better plan is to use the AFE tester if you have it.
- (near U1) ADCx_INP9
- https://blog.adafruit.com/2012/01/24/choosing-the-right-crystal-and-caps-for-your-design/
- 2*C_L - 2*C_stray = load needed
- 2*6 - 2*3 = 6 pF
- Should blink on PPS
- <--
- -->
- 0805 to avoid smoke on short
- RFI filter
- (near R280) VCP UART naming is from MCU perspective
- B00T0(low) = FLASH boot
- BOOT0(high) && BOOT1(low) = system bootloader
- SPI2 nSS (RESERVED)
- (near D1) TIM8_CH1
- (near D1) TIM8_CH2
- (near D1) TIM8_CH3
- <->
- 2*C_L - 2*C_stray = 15 pF (assume C_Stray is 5 pF)
- (near R52) -->
- (in symbol 3DP_STDC14_TAPE_FRAME) SECURITY
- (in symbol FTSH-107-01-L-DV-K-A) STDC14 debug connector

## Library data of the parts
C1 C2 C4-C6 C8-C10 C43 C45 C63-C66 = CL05B104KB54PNC: Manufacturer: Samsung Electro-Mechanics; Voltage Rating: 50 V; Dielectric: X7R; ComponentLink1URL: https://wmsc.lcsc.com/wmsc/upload/file/pdf/v2/lcsc/2304140030_Samsung-Electro-Mechanics-CL05B104KB54PNC_C307331.pdf; ComponentLink1Description: Datasheet; Manufacturer Part Number: CL05B104KB54PNC; Package: 0402; Supplier 2: LCSC; Supplier Part Number 2: C307331
C3 C11 = CL05B103KB5NNNC: Manufacturer: Samsung Electro-Mechanics; Dielectric: X7R; ComponentLink1URL: https://wmsc.lcsc.com/wmsc/upload/file/pdf/v2/lcsc/2304140030_Samsung-Electro-Mechanics-CL05B103KB5NNNC_C15195.pdf; ComponentLink1Description: Datasheet; Manufacturer Part Number: CL05B103KB5NNNC; Package: 0402; Supplier 2: LCSC; Supplier Part Number 2: C15195
C7 C68 C69 C75 C169 C177 = CL05B104KB54PNC: Manufacturer: Samsung Electro-Mechanics; Dielectric: X7R; ComponentLink1URL: https://wmsc.lcsc.com/wmsc/upload/file/pdf/v2/lcsc/2304140030_Samsung-Electro-Mechanics-CL05B104KB54PNC_C307331.pdf; ComponentLink1Description: Datasheet; Manufacturer Part Number: CL05B104KB54PNC; Package: 0402; Supplier 2: LCSC; Supplier Part Number 2: C307331
C12 C13 = CL10A106MA8NRNC: Manufacturer: Samsung Electro-Mechanics; Dielectric: X5R; ComponentLink1URL: https://wmsc.lcsc.com/wmsc/upload/file/pdf/v2/lcsc/2304140030_Samsung-Electro-Mechanics-CL10A106MA8NRNC_C96446.pdf; ComponentLink1Description: Datasheet; Manufacturer Part Number: CL10A106MA8NRNC; Package: 0603; Supplier 2: LCSC; Supplier Part Number 2: C96446
C14 = 0402CG270J500NT: Manufacturer: FH(Guangdong Fenghua Advanced Tech); Dielectric: C0G; ComponentLink1URL: https://wmsc.lcsc.com/wmsc/upload/file/pdf/v2/lcsc/2304140030_FH--Guangdong-Fenghua-Advanced-Tech-0402CG270J500NT_C1557.pdf; ComponentLink1Description: Datasheet; Manufacturer Part Number: 0402CG270J500NT; Package: 0402; Supplier 2: LCSC; Supplier Part Number 2: C1557
C15 C16 = 0402CG6R0C500NT: Manufacturer: FH(Guangdong Fenghua Advanced Tech); Dielectric: C0G; ComponentLink1URL: https://wmsc.lcsc.com/wmsc/upload/file/pdf/v2/lcsc/2304140030_FH--Guangdong-Fenghua-Advanced-Tech-0402CG6R0C500NT_C1575.pdf; ComponentLink1Description: Datasheet; Manufacturer Part Number: 0402CG6R0C500NT; Package: 0402; Supplier 2: LCSC; Supplier Part Number 2: C1575
C17 C18 = 0402CG150J500NT: Manufacturer: FH(Guangdong Fenghua Advanced Tech); Dielectric: C0G; ComponentLink1URL: https://wmsc.lcsc.com/wmsc/upload/file/pdf/v2/lcsc/2304140030_FH--Guangdong-Fenghua-Advanced-Tech-0402CG150J500NT_C1548.pdf; ComponentLink1Description: Datasheet; Manufacturer Part Number: 0402CG150J500NT; Package: 0402; Supplier 2: LCSC; Supplier Part Number 2: C1548
C67 C180 = GMK107AB7105KAHT: Manufacturer: Taiyo Yuden; Dielectric: X7R; ComponentLink1URL: https://datasheet.lcsc.com/lcsc/2304140030_Taiyo-Yuden-GMK107AB7105KAHT_C841050.pdf; ComponentLink1Description: Datasheet; Manufacturer Part Number: GMK107AB7105KAHT; Package: 0603; Supplier 2: LCSC; Supplier Part Number 2: C841050
C76 = 04023A221JAT2A: Manufacturer: AVX; Dielectric: C0G; ComponentLink1URL: https://wmsc.lcsc.com/wmsc/upload/file/pdf/v2/lcsc/2304140030_Kyocera-AVX-04023A221JAT2A_C597005.pdf; ComponentLink1Description: Datasheet; Manufacturer Part Number: 04023A221JAT2A; Package: 0402; Supplier 2: LCSC; Supplier Part Number 2: C597005
D1 = XL-3528RGBW-HM: LED Multi-Color Chip Red/Green/Blue 621nm/525nm/468nm 25mA/15mA/15mA 4-Pin PLCC T/R; Manufacturer: XINGLIGHT; LED Color: RGB; Supplier 1: DigiKey; Supplier Part Number 1: 5962-XL-3528RGBW-HMTR-ND; Manufacturer Part Number: XL-3528RGBW-HM; ComponentLink1Description: Datasheet; ComponentLink1URL: https://mm.digikey.com/Volume0/opasdata/d220001/medias/docus/8903/XL-3528RGBW-HM.pdf; Supplier 2: LCSC; Supplier Part Number 2: C2843813
D45 = BAT54SLT1G: DIODE SCHOTTKY DUAL 30V SOT23; Manufacturer: ON Semiconductor; Current: 200 mA; Supplier 1: DigiKey; Manufacturer Part Number: BAT54SLT1G; ComponentLink1URL: https://www.onsemi.com/pdf/datasheet/bat54slt1-d.pdf; ComponentLink1Description: Datasheet; Supplier Part Number 1: BAT54SLT1GOSCT-ND; Supplier 2: LCSC; Supplier Part Number 2: C19726; Diode Type: Schottky; Vr: 30 V; Supplier 3: Mouser; Supplier Part Number 3: 863-BAT54SLT1G
D46 = LTST-C190GKT: LED GREEN CLEAR 0603 SMD; Manufacturer: Lite-On Inc; Vf: 2.0 V; If: 20 mA; Supplier 1: DigiKey; ComponentLink1URL: https://mm.digikey.com/Volume0/opasdata/d220001/medias/docus/858/LTST-C190GKT.pdf; ComponentLink1Description: Datasheet; Supplier Part Number 1: 160-1183-1-ND; Manufacturer Part Number: LTST-C190GKT; Supplier 2: LCSC; Supplier Part Number 2: C125093; LED Color: Green; Supplier 3: Mouser; Supplier Part Number 3: 859-LTST-C190GKT
FB2 = BLM15AX601SN1D: Manufacturer: Murata Electronics; Z @ 100 MHz: 600; DCR (mOhms): 340; ComponentLink1URL: https://wmsc.lcsc.com/wmsc/upload/file/pdf/v2/lcsc/2304140030_Murata-Electronics-BLM15AX601SN1D_C76886.pdf; ComponentLink1Description: Datasheet; Manufacturer Part Number: BLM15AX601SN1D; Supplier 2: LCSC; Supplier Part Number 2: C76886; Package: 0402
H1 = 3DP_STDC14_TAPE_FRAME: 3D-printed plastic frame used for security tape around STDC14 programming header; Manufacturer: SSCP; Manufacturer Part Number: 3DP_STDC14_TAPE_FRAME; Supplier 3: SSCP; Supplier Part Number 3: N/A
J1 = FTSH-107-01-L-DV-K-A: Connector Header Surface Mount 14 position 0.050" (1.27mm); Manufacturer: Samtec; Supplier 1: DigiKey; Supplier Part Number 1: FTSH-107-01-L-DV-K-A-ND; Manufacturer Part Number: FTSH-107-01-L-DV-K-A; Supplier 2: LCSC; Supplier Part Number 2: C5563894; Supplier 3: Mouser; Supplier Part Number 3: 200-FTSH10701LDVKA; ComponentLink1Description: Datasheet; ComponentLink1URL: https://mm.digikey.com/Volume0/opasdata/d220001/medias/docus/6209/ftsh-1xx-xx-xxx-dv-xxx-xxx-x-xx-mkt.pdf
L5 = DFE201612E-2R2M=P2: 2.2 µH metal alloy power inductor; Manufacturer: Murata Electronics; DCR (mOhms): 116; Inductance (µH): 2.2; Manufacturer Part Number: DFE201612E-2R2M=P2; Supplier 1: DigiKey; Supplier Part Number 1: 490-DFE201612E-2R2M=P2CT-ND; Supplier 2: LCSC; Supplier Part Number 2: C337893; ComponentLink1Description: Datasheet; ComponentLink1URL: https://pim.murata.com/asset/pim4/inductor/J(E)TE243A-0006_PDF_INDUCTOR; Supplier 3: Mouser; Supplier Part Number 3: 81-DFE201612E-2R2MP2
Q12 = MMBT3904T: Bipolar (BJT) Transistor NPN 40 V 200 mA 300MHz 150 mW Surface Mount SOT-523; Manufacturer: Shenzhen Slkormicro Semicon Co., Ltd.; Supplier 1: DigiKey; Supplier Part Number 1: 5399-MMBT3904TCT-ND; Manufacturer Part Number: MMBT3904T; ComponentLink1Description: Datasheet; ComponentLink1URL: https://mm.digikey.com/Volume0/opasdata/d220001/medias/docus/7136/5399_MMBT3904T%20SOT-523.pdf; Supplier 2: LCSC; Supplier Part Number 2: C61616; Polarity: NPN
R1-R3 R5-R7 R11 R15-R19 R21-R23 R25-R29 R31-R38 R40 R41 R43-R51 R53 R56 R95 R99 R258-R263 R280 R287 R294 R319-R321 R324 = 0402WGF330JTCE: Manufacturer: UNI-ROYAL(Uniroyal Elec); Tolerance: 1%; Temperature Coefficient: ±100ppm/?; Power Rating (mW): 62.5; ComponentLink1Description: Datasheet; ComponentLink1URL: https://wmsc.lcsc.com/wmsc/upload/file/pdf/v2/lcsc/2205311900_UNI-ROYAL-Uniroyal-Elec-0402WGF330JTCE_C25105.pdf; Manufacturer Part Number: 0402WGF330JTCE; Package: 0402; Supplier 2: LCSC; Supplier Part Number 2: C25105
R4 R312 R322 R323 R337 = 0402WGF1002TCE: Manufacturer: UNI-ROYAL(Uniroyal Elec); Power Rating (mW): 62.5; Tolerance: 1%; Temperature Coefficient: ±100ppm/?; Manufacturer Part Number: 0402WGF1002TCE; Package: 0402; Supplier 2: LCSC; Supplier Part Number 2: C25744; ComponentLink1Description: Datasheet; ComponentLink1URL: https://wmsc.lcsc.com/wmsc/upload/file/pdf/v2/lcsc/2206010100_UNI-ROYAL-Uniroyal-Elec-0402WGF1002TCE_C25744.pdf
R8 R12 R254 = 0402WGF3300TCE: Manufacturer: UNI-ROYAL(Uniroyal Elec); Tolerance: 1%; Temperature Coefficient: ±100ppm/?; Power Rating (mW): 62.5; ComponentLink1Description: Datasheet; ComponentLink1URL: https://wmsc.lcsc.com/wmsc/upload/file/pdf/v2/lcsc/2205311900_UNI-ROYAL-Uniroyal-Elec-0402WGF3300TCE_C25104.pdf; Manufacturer Part Number: 0402WGF3300TCE; Package: 0402; Supplier 2: LCSC; Supplier Part Number 2: C25104
R9 = CRCW04021R00FKEDC: Manufacturer: Vishay Intertech; Tolerance: 1%; Temperature Coefficient: ±100ppm/?; Power Rating (mW): 62.5; ComponentLink1Description: Datasheet; ComponentLink1URL: https://datasheet.lcsc.com/lcsc/2304140030_Vishay-Intertech-CRCW04021R00FKEDC_C2077765.pdf; Manufacturer Part Number: CRCW04021R00FKEDC; Package: 0402; Supplier 2: LCSC; Supplier Part Number 2: C2077765
R10 = FRC0402F2670TS: Manufacturer: FOJAN; Tolerance: 1%; Temperature Coefficient: ±100ppm/?; Power Rating (mW): 62.5; ComponentLink1Description: Datasheet; ComponentLink1URL: https://datasheet.lcsc.com/lcsc/2308241947_FOJAN-FRC0402F2670TS_C2998075.pdf; Manufacturer Part Number: FRC0402F2670TS; Package: 0402; Supplier 2: LCSC; Supplier Part Number 2: C2998075
R13 = RTT029760FTH: Manufacturer: RALEC; Tolerance: 1%; Temperature Coefficient: ±100ppm/?; Power Rating (mW): 62.5; ComponentLink1Description: Datasheet; ComponentLink1URL: https://wmsc.lcsc.com/wmsc/upload/file/pdf/v2/lcsc/2304140030_RALEC-RTT029760FTH_C11710.pdf; Manufacturer Part Number: RTT029760FTH; Package: 0402; Supplier 2: LCSC; Supplier Part Number 2: C11710
R14 = ERJ2RKF1870X: Manufacturer: PANASONIC; Tolerance: 1%; Temperature Coefficient: ±100ppm/?; Power Rating (mW): 100; ComponentLink1Description: Datasheet; ComponentLink1URL: https://wmsc.lcsc.com/wmsc/upload/file/pdf/v2/lcsc/1912111437_PANASONIC-ERJ2RKF1870X_C416489.pdf; Manufacturer Part Number: ERJ2RKF1870X; Package: 0402; Supplier 2: LCSC; Supplier Part Number 2: C416489
R20 = ERJP06F1000V: Manufacturer: PANASONIC; Tolerance: 1%; Temperature Coefficient: ±100ppm/?; Power Rating (mW): 500; ComponentLink1Description: Datasheet; ComponentLink1URL: https://wmsc.lcsc.com/wmsc/upload/file/pdf/v2/lcsc/2404150944_PANASONIC-ERJP06F1000V_C441975.pdf; Manufacturer Part Number: ERJP06F1000V; Package: 0805; Supplier 2: LCSC; Supplier Part Number 2: C441975
R30 R332 = 0402WGF1002TCE: Manufacturer: UNI-ROYAL(Uniroyal Elec); Tolerance: 1%; Temperature Coefficient: ±100ppm/?; Power Rating (mW): 62.5; ComponentLink1Description: Datasheet; ComponentLink1URL: https://wmsc.lcsc.com/wmsc/upload/file/pdf/v2/lcsc/2206010100_UNI-ROYAL-Uniroyal-Elec-0402WGF1002TCE_C25744.pdf; Manufacturer Part Number: 0402WGF1002TCE; Package: 0402; Supplier 2: LCSC; Supplier Part Number 2: C25744
R39 = 0402WGF1001TCE: Manufacturer: UNI-ROYAL(Uniroyal Elec); Tolerance: 1%; Temperature Coefficient: ±100ppm/?; Power Rating (mW): 62.5; ComponentLink1Description: Datasheet; ComponentLink1URL: https://wmsc.lcsc.com/wmsc/upload/file/pdf/v2/lcsc/2206010216_UNI-ROYAL-Uniroyal-Elec-0402WGF1001TCE_C11702.pdf; Manufacturer Part Number: 0402WGF1001TCE; Package: 0402; Supplier 2: LCSC; Supplier Part Number 2: C11702
R42 R55 = 0402WGF0000TCE: Manufacturer: UNI-ROYAL(Uniroyal Elec); Power Rating (mW): 62.5; ComponentLink1Description: Datasheet; ComponentLink1URL: https://wmsc.lcsc.com/wmsc/upload/file/pdf/v2/lcsc/2206010216_UNI-ROYAL-Uniroyal-Elec-0402WGF0000TCE_C17168.pdf; Manufacturer Part Number: 0402WGF0000TCE; Package: 0402; Supplier 2: LCSC; Supplier Part Number 2: C17168
R52 R54 R97 = 0402WGF1501TCE: Manufacturer: UNI-ROYAL(Uniroyal Elec); Tolerance: 1%; Temperature Coefficient: ±100ppm/?; Power Rating (mW): 62.5; ComponentLink1Description: Datasheet; ComponentLink1URL: https://wmsc.lcsc.com/wmsc/upload/file/pdf/v2/lcsc/2206010045_UNI-ROYAL-Uniroyal-Elec-0402WGF1501TCE_C25867.pdf; Manufacturer Part Number: 0402WGF1501TCE; Package: 0402; Supplier 2: LCSC; Supplier Part Number 2: C25867
R154 = 0402WGF2201TCE: Manufacturer: UNI-ROYAL(Uniroyal Elec); Tolerance: 1%; Temperature Coefficient: ±100ppm/?; Power Rating (mW): 62.5; ComponentLink1Description: Datasheet; ComponentLink1URL: https://wmsc.lcsc.com/wmsc/upload/file/pdf/v2/lcsc/2206010045_UNI-ROYAL-Uniroyal-Elec-0402WGF2201TCE_C25879.pdf; Manufacturer Part Number: 0402WGF2201TCE; Package: 0402; Supplier 2: LCSC; Supplier Part Number 2: C25879
S1 = CHS-04TA: DIP Switch, Slide, SPST, Flush, Recessed, 6VDC, 100mA, CHS Series Ž Nidec Components CHS-04TA; Manufacturer: Nidec Copal; Supplier 1: DigiKey; Supplier Part Number 1: 563-1007-1-ND; Manufacturer Part Number: CHS-04TA; Supplier 2: LCSC; Supplier Part Number 2: C2921610; ComponentLink1Description: Datasheet; ComponentLink1URL: https://www.nidec-components.com/e/catalog/switch/chs.pdf; Supplier 3: Mouser; Supplier Part Number 3: 229-CHS-04TA
S2 S3 = TS-1092S-B3D2-G: SWITCH TACTILE SPST-NO; Manufacturer: Yuandi; Manufacturer Part Number: TS-1092S-B3D2-G; ComponentLink1Description: Datasheet; ComponentLink1URL: https://www.lcsc.com/datasheet/lcsc_datasheet_2005071437_Yuandi-TS-1092S-B3D2-G_C520860.pdf; Supplier 2: LCSC; Supplier Part Number 2: C520860
TP1 TP2 = RH-5002: White through-hole PCB test point; Manufacturer: ronghe; ComponentLink1Description: Datasheet; ComponentLink1URL: https://datasheet.lcsc.com/lcsc/2307040929_ronghe-RH-5000_C5277086.pdf; Manufacturer Part Number: RH-5002; Supplier 2: LCSC; Supplier Part Number 2: C5199802
TP51 = RH-5000: Red through-hole PCB test point; Manufacturer: ronghe; ComponentLink1Description: Datasheet; ComponentLink1URL: https://datasheet.lcsc.com/lcsc/2307040929_ronghe-RH-5000_C5277086.pdf; Manufacturer Part Number: RH-5000; Supplier 2: LCSC; Supplier Part Number 2: C5277086
TP52 = RH-5001: Black through-hole PCB test point; Manufacturer: ronghe; ComponentLink1Description: Datasheet; ComponentLink1URL: https://datasheet.lcsc.com/lcsc/2307040929_ronghe-RH-5000_C5277086.pdf; Manufacturer Part Number: RH-5001; Supplier 2: LCSC; Supplier Part Number 2: C5199801
U1 = STM32H5F5LJH7Q: ARM® Cortex®-M33F STM32H5 Microcontroller IC 32-Bit 250MHz 4MB (4M x 8) FLASH 225-TFBGA (13x13); Manufacturer: STMicroelectronics; ComponentLink1Description: Datasheet; ComponentLink1URL: https://www.st.com/resource/en/datasheet/stm32h5f5lj.pdf; ComponentLink2Description: Reference Manual; ComponentLink2URL: https://www.st.com/resource/en/reference_manual/rm0517-stm32h5e45f4-and-stm32h5e55f5-armbased-32bit-mcus-stmicroelectronics.pdf; Manufacturer Part Number: STM32H5F5LJH7Q; Supplier 1: DigiKey; Supplier Part Number 1: 497-STM32H5F5LJH7Q-ND; Supplier 3: Mouser; Supplier Part Number 3: 511-STM32H5F5LJH7Q
X1 = XRCGB16M000FXN00R0: CRYSTAL 16.0000MHZ 6PF SMD; Manufacturer: Murata; Supplier 1: DigiKey; Supplier Part Number 1: 490-18282-1-ND; Manufacturer Part Number: XRCGB16M000FXN00R0; Supplier 2: LCSC; Supplier Part Number 2: C5222893; ComponentLink1Description: Datasheet; ComponentLink1URL: https://www.murata.com/products/productdata/8801076543518/SPEC-XRCGB25M000F3A00R0.pdf; Supplier 3: Mouser; Supplier Part Number 3: 81-XRCGB16M000FXN00R
X2 = 9HT10-32.768KEZF-T: CRYSTAL 32.768 KHZ 12.5 PF SMD; Manufacturer: TXC CORPORATION; Supplier 1: DigiKey; Manufacturer Part Number: 9HT10-32.768KEZF-T; ComponentLink1URL: http://www.txccrystal.com/images/pdf/9ht10.pdf; ComponentLink1Description: Datasheet; Supplier Part Number 1: 887-1507-1-ND; Supplier 2: LCSC; Supplier Part Number 2: C5932452; Supplier 3: Mouser; Supplier Part Number 3: 717-9HT10-32.768KEZF